# EAGLE schematic untitled (EAGLE 6.1)
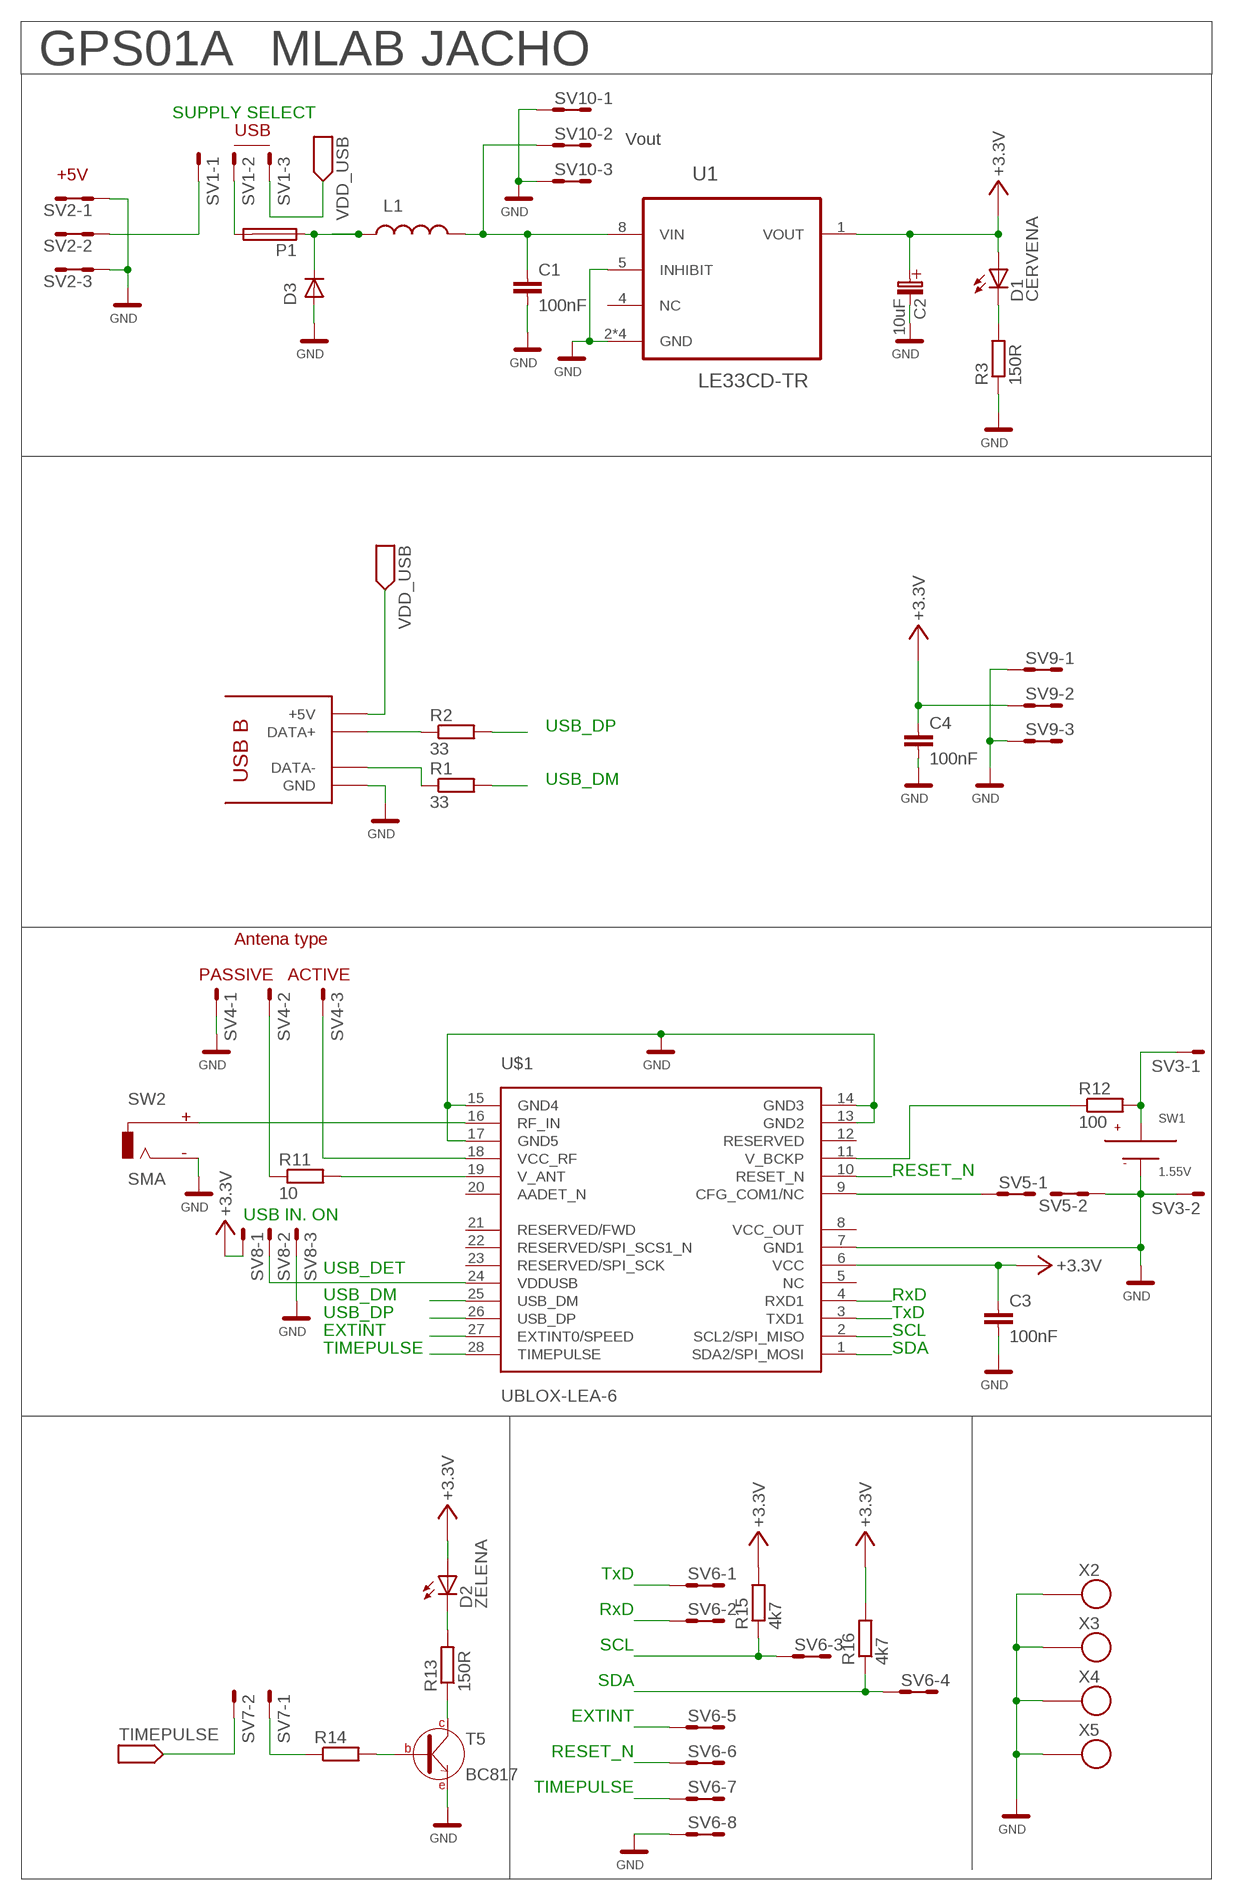
[diagram p0: schematic, sheet 1]

## Parts
C1  100nF  C0805  [C0805]
C2  10uF  B  [B]
C3  100nF  C0805  [C0805]
C4  100nF  C0805  [C0805]
D1  CERVENA  LED1206  [1206]
D2  ZELENA  LED1206  [1206]
D3  D-OB.SMA  [SMA]
L1  L1210  [1210]
P1  POJISTKA_1812  [1812]
R1  33  R0805  [0805]
R2  33  R0805  [0805]
R3  150R  R0805  [0805]
R11  10  R0805  [0805]
R12  100  R0805  [0805]
R13  150R  R0805  [0805]
R14  R0805  [0805]
R15  4k7  R0805  [0805]
R16  4k7  R0805  [0805]
SV1  MA03-1  [MA03-1]
SV2  MA03-2  [MA03-2]
SV3  MA02-1  [MA02-1]
SV4  MA03-1  [MA03-1]
SV5  MA02-2  [MA02-2]
SV6  MA08-2  [MA08-2]
SV7  MA02-1  [MA02-1]
SV8  MA03-1  [MA03-1]
SV9  MA03-2  [MA03-2]
SV10  MA03-2  [MA03-2]
SW1  1.55V  BAT6MM8  [BAT6MM8]
SW2  SMA  [SMA]
T5  BC817  [SOT23]
U1  LE33CD-TR  [SOIC127P600X175-8N]
U$1  UBLOX-LEA-6  [UBLOX-LEA-6]
X1  USB_B  [USB_B]
X2  SROUB3M  [SROUB3M]
X3  SROUB3M  [SROUB3M]
X4  SROUB3M  [SROUB3M]
X5  SROUB3M  [SROUB3M]

## Nets
+3.3V: C2.+(C_EL+) C3.1 C4.1 D1.A D2.A R15.2 R16.2 SV8.1 SV9.3 SV9.4 U1.1(VOUT) U$1.6(VCC)
EXTINT: SV6.9 SV6.10 U$1.27(EXTINT0/SPEED)
GND: C1.2 C2.-(C_EL-) C3.2 C4.2 D3.A R3.1 SV2.1 SV2.2 SV2.5 SV2.6 SV3.2 SV4.1 SV5.3 SV5.4 SV6.15 SV6.16 SV8.3 SV9.1 SV9.2 SV9.5 SV9.6 SV10.1 SV10.2 SV10.5 SV10.6 SW1.- SW2.-1(-) SW2.-2(-) SW2.-3(-) SW2.-4(-) T5.2(E) U1.2(GND) U1.3(GND) U1.5(INHIBIT) U1.6(GND) U1.7(GND) U$1.7(GND1) U$1.13(GND2) U$1.14(GND3) U$1.15(GND4) U$1.17(GND5) X1.4(GND) X1.GND X1.GND2(GND) X2.P$1 X3.P$1 X4.P$1 X5.P$1
N$1: SW2.+ U$1.16(RF_IN)
N$2: SV1.1 SV2.3 SV2.4
N$3: R1.1 X1.2(DATA-)
N$4: R2.1 X1.3(DATA+)
N$5: C1.1 L1.P$2 SV10.3 SV10.4 U1.8(VIN)
N$7: P1.2 SV1.2
N$9: D1.K(C) R3.2
N$11: R11.2 U$1.19(V_ANT)
N$12: D3.K(C) L1.P$1 P1.1
N$13: R11.1 SV4.2
N$14: R12.1 U$1.11(V_BCKP)
N$15: R12.2 SV3.1 SW1.1+(+) SW1.2+(+)
N$16: SV5.1 SV5.2 U$1.9(CFG_COM1/NC)
N$24: D2.K(C) R13.2
N$25: R13.1 T5.3(C)
N$26: R14.2 T5.1(B)
N$27: R14.1 SV7.1
RESET_N: SV6.11 SV6.12 U$1.10(RESET_N)
RXD: SV6.3 SV6.4 U$1.4(RXD1)
SCL: R15.1 SV6.5 SV6.6 U$1.2(SCL2/SPI_MISO)
SDA: R16.1 SV6.7 SV6.8 U$1.1(SDA2/SPI_MOSI)
TIMEPULSE: SV6.13 SV6.14 SV7.2 U$1.28(TIMEPULSE)
TXD: SV6.1 SV6.2 U$1.3(TXD1)
USB_DET: SV8.2 U$1.24(VDDUSB)
USB_DM: R1.2 U$1.25(USB_DM)
USB_DP: R2.2 U$1.26(USB_DP)
VCC_RF: SV4.3 U$1.18(VCC_RF)
VDD_USB: SV1.3 X1.1(+5V)
Unconnected: U1.4(NC) U$1.5(NC) U$1.8(VCC_OUT) U$1.12(RESERVED) U$1.20(AADET_N) U$1.21(RESERVED/FWD) U$1.22(RESERVED/SPI_SCS1_N) U$1.23(RESERVED/SPI_SCK)

## Notes on the sheet
- GPS01A | MLAB | JACHO
- SUPPLY SELECT
- USB
- Vout
- +5V
- USB_DP
- USB_DM
- Antena type
- PASSIVE | ACTIVE
- RESET_N
- USB IN. ON
- USB_DET
- USB_DM | RxD
- USB_DP | TxD
- EXTINT | SCL
- TIMEPULSE | SDA
- TxD
- RxD
- SCL
- SDA
- EXTINT
- RESET_N
- TIMEPULSE

## Library data of the parts
C1 C3 C4 = moje_C:C0805
C2 = moje_C:B
D1 D2 = moje_diody:LED1206: Ecom LEDS-HCL-1505
D3 = moje:D-OB.SMA: SMA
L1 = moje_L:L1210
P1 = moje:POJISTKA_1812: Pojistka s pouzdrem 1812
R1-R3 R11-R16 = moje_R:R0805
SV1 SV4 SV8 = moje_hrebinky:MA03-1: PIN HEADER; OC_FARNELL: unknown; OC_NEWARK: unknown
SV2 SV9 SV10 = moje_hrebinky:MA03-2: PIN HEADER; OC_FARNELL: unknown; OC_NEWARK: unknown
SV3 SV7 = moje_hrebinky:MA02-1
SV5 = moje_hrebinky:MA02-2
SV6 = moje_hrebinky:MA08-2: PIN HEADER; OC_FARNELL: unknown; OC_NEWARK: unknown
SW1 = moje_baterky:BAT6MM8: Baterka o prumeru 6,8mm vyska ruzna. Typ SR66, R626SR626. TME KEYS2998
SW2 = moje_konektory:SMA
T5 = moje_T:BC817: BC817 NPN tranzistor
U1 = moje_U:LE33CD-TR: Very low drop voltage regulators with inhibit; MPN: LE33CD-TR; OC_FARNELL: 1652371; OC_NEWARK: 89K1279; PACKAGE: SOIC-8; SUPPLIER: STMICROELECTRONICS
U$1 = 3DRobotics:UBLOX-LEA-6: u-blox LEA-6 GPS Module The LEA-6 module series is a family of stand-alone GPS receivers featuring the high performance u-blox 6 positioning engine. These versatile receivers feature an extensive and flexible range of functionality, connectivity and cost savings options. LEA-6 modules maintain the industry standard 17.0 x 22.4mm form factor of the LEA-5 series and have been designed to allow simple migration. Their ease of integration results in reduced costs and short time to market for a wide range of automotive, consumer and industrial applications. The 50-channel u-blox 6 positioning engine boasts a Time-To-First-Fix (TTFF) of under 1 second. The dedicated acquisition engine, with over 2 million correlators, is capable of massive parallel time/frequency space searches, enabling it to find satellites instantly. Innovative design and technology suppresses interference sources and mitigates multipath effects, giving LEA-6 GPS receivers excellent navigation performance even in the most challenging environments.; DATASHEET: http://www.u-blox.com/images/downloads/Product_Docs/LEA-6_DataSheet_%28GPS.G6-HW-09004%29.pdf; LINK: http://www.u-blox.com/en/gps-modules/pvt-modules/lea-6-family.html; MFGPN: LEA-6
X1 = moje_konektory:USB_B
X2-X5 = moje:SROUB3M